# Altium schematic sheet Interface.SchDoc: Krapong-ROV, F-Tube (Sensor, Interface)
size A4; DocumentNumber: 3; SheetNumber: 4; SheetTotal: 4; PageSetup: Record=PageOptions|CenterHorizontal=True|CenterVertical=True|PrintScale=0.97|XCorrection=1.00|YCorrection=1.00|PrintKind=0|BorderSize=5000000|LeftOffset=0|BottomOffset=0|Orientation=2|PaperLength=1000|PaperWidth=1000|Scale=100|PaperSource=7|PrintQuality=-3|MediaType=1|DitherType=10|PrintScaleMode=1|PaperKind=A4|PaperIndex=9
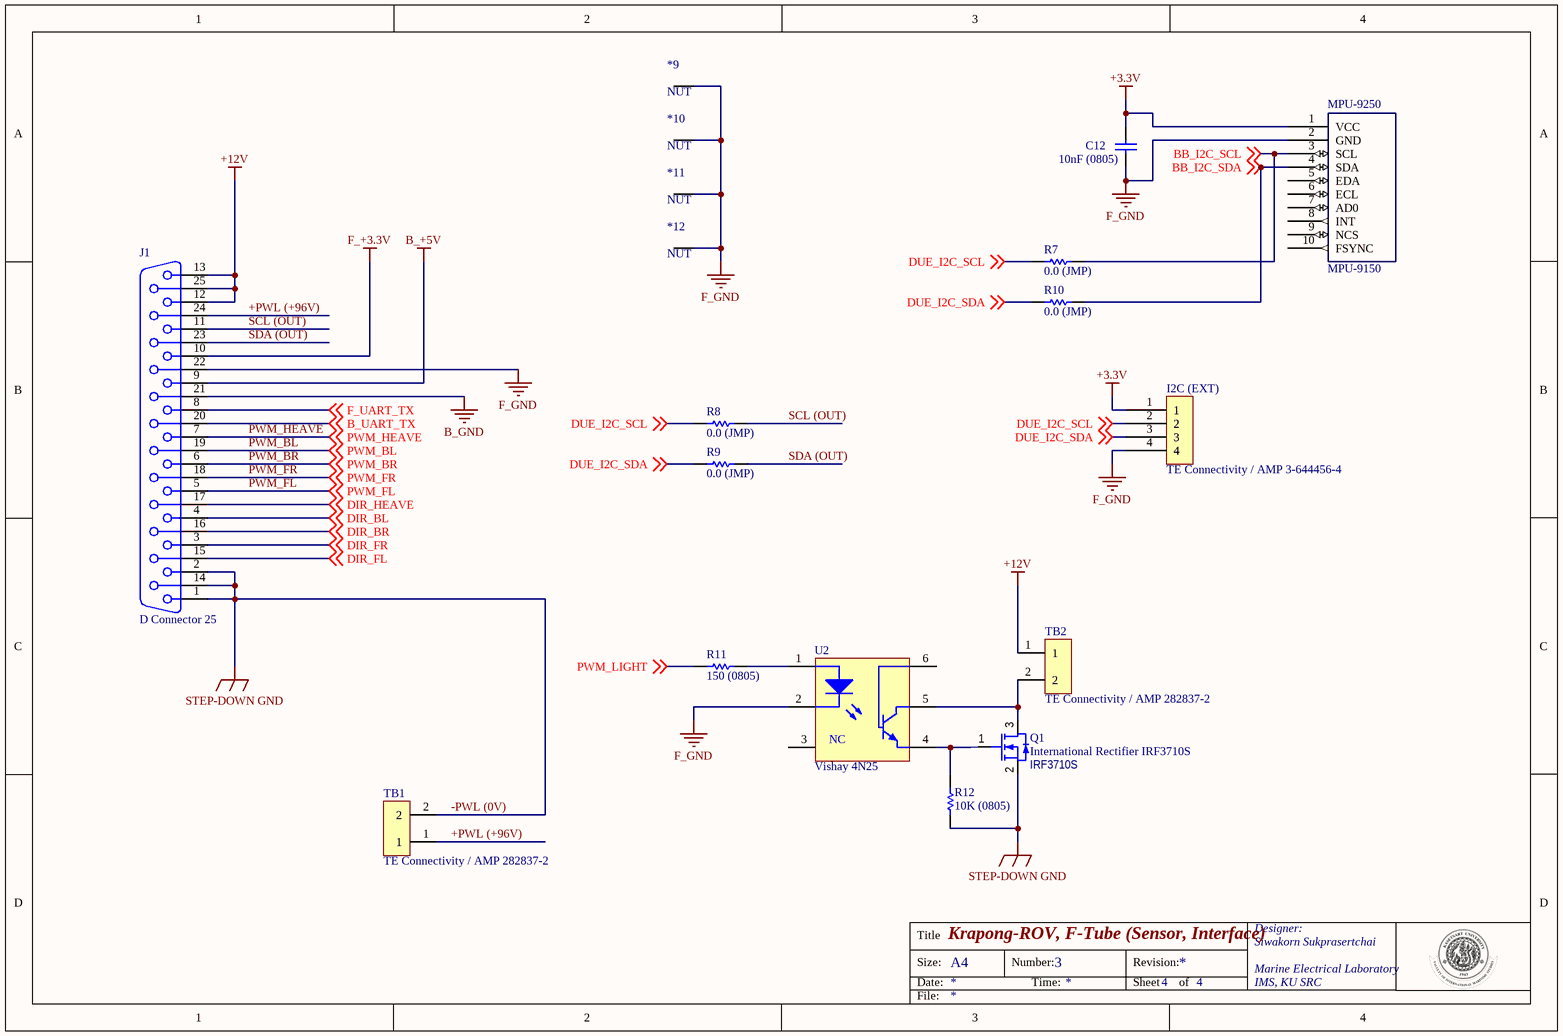
[diagram p0: Interface.SchDoc]

## Parts
*9  NUT  [PCB-pcj1l6roq5gpi9u538ps-1]
*10  NUT  [PCB-pcj1l6roq5gpi9u538ps-1]
*11  NUT  [PCB-pcj1l6roq5gpi9u538ps-1]
*12  NUT  [PCB-pcj1l6roq5gpi9u538ps-1]
C12  10nF (0805)  [CAPC2013X94X50NL20T25]
I2C_(EXT)  TE Connectivity / AMP 3-644456-4  [PCB-rz6n0fnwkrymh4bzf5j3-1]
J1  D Connector 25  [PCB-w6wyndea0hgjvu195v0z-1]
MPU-9250  MPU-9150  [PCB-qjnj89ydof8zhvyyt2pp-1]
Q1  International Rectifier IRF3710S  Vlaue: IRF3710S  [PCB-knfcvcmaqkz1jt91xuml-1]
R7  0.0 (JMP)  [RESC2013X60X35ML10T20]
R8  0.0 (JMP)  [RESC2013X60X35ML10T20]
R9  0.0 (JMP)  [RESC2013X60X35ML10T20]
R10  0.0 (JMP)  [RESC2013X60X35ML10T20]
R11  150 (0805)  [RESC2013X60X40NL15T20]
R12  10K (0805)  [RESC2013X60X40NL15T20]
TB1  TE Connectivity / AMP 282837-2  [PCB-suk0edwv8aq1tcw7107x-1]
TB2  TE Connectivity / AMP 282837-2  [PCB-suk0edwv8aq1tcw7107x-1]
U2  Vishay 4N25  [PCB-jnahbn6qvly565f94r9b-1]

## Nets
+3.3V: C12.2 I2C_(EXT).1 MPU-9250.1(VCC)
+12V: J1.12 J1.13 J1.25 TB2.1
-PWL (0V): J1.1 J1.2 J1.14 Q1.2(S) R12.1 TB1.2  [also labelled STEP-DOWN GND]
B_+5V: J1.9
B_GND: J1.21
F_+3.3V: J1.10
F_GND: *9.0 *10.0 *11.0 *12.0 C12.1 I2C_(EXT).4 J1.22 MPU-9250.2(GND) U2.2
+PWL (+96V): J1.24 TB1.1
B_UART_TX: J1.20 ; off-sheet B_UART_TX
BB_I2C_SCL: MPU-9250.3(SCL) R7.1 ; off-sheet BB_I2C_SCL
BB_I2C_SDA: MPU-9250.4(SDA) R10.1 ; off-sheet BB_I2C_SDA
DIR_BL: J1.4 ; off-sheet DIR_BL
DIR_BR: J1.16 ; off-sheet DIR_BR
DIR_FL: J1.15 ; off-sheet DIR_FL
DIR_FR: J1.3 ; off-sheet DIR_FR
DIR_HEAVE: J1.17 ; off-sheet DIR_HEAVE
DUE_I2C_SCL: I2C_(EXT).2 R7.2 R8.2 ; off-sheet DUE_I2C_SCL
DUE_I2C_SDA: I2C_(EXT).3 R9.2 R10.2 ; off-sheet DUE_I2C_SDA
F_UART_TX: J1.8 ; off-sheet F_UART_TX
PWM_BL: J1.19 ; off-sheet PWM_BL
PWM_BR: J1.6 ; off-sheet PWM_BR
PWM_FL: J1.5 ; off-sheet PWM_FL
PWM_FR: J1.18 ; off-sheet PWM_FR
PWM_HEAVE: J1.7 ; off-sheet PWM_HEAVE
PWM_LIGHT: R11.2 ; off-sheet PWM_LIGHT
SCL (OUT): J1.11 R8.1
SDA (OUT): J1.23 R9.1
NetQ1_1: Q1.1(G) R12.2 U2.4
NetQ1_3: Q1.3(D) TB2.2 U2.5
NetR11_1: R11.1 U2.1

Not connected (* = marked no-connect by the designer): MPU-9250 5(EDA) 6(ECL) 7(AD0) 8(INT) 9(NCS) 10(FSYNC); U2 3 6

## Notes on the sheet
- Title
- Size:
- Date:
- A4
- Number:
- Time:
- Revision:
- Sheet
- of
- Designer:
- Siwakorn Sukprasertchai
- Marine Electrical Laboratory
- IMS, KU SRC
- File:
- (in symbol CMP-1524877-3) NC

## Library data of the parts
*9-*12 = CMP-5ddc94dc62be821b-2: Standoff; 12 mm; M3 x 0.5; Brass; Hex; Nickel Plate; 8 in.; 8 in.; Manufacturer Part Number: 24314; Lead-Free Status: Lead Free; Size-Width: 5.00 mm; Octopart URL: http://octopart.com/24314-keystone-662020; OctopartID: 5ddc94dc62be821b; Size-Length: 12.0 mm; Material: Brass; RoHS: Compliant
C12 = CMP-16466678-5: CAP CER 10NF 50V 5% X7R 0805; Manufacturer Part Number: 08055C103JAT2A; Case/Package (SI): 2012; Capacitance: 1e-08 F; Voltage Rating (DC): 50.0 V; Dielectric Material: Ceramic Multilayer; Lead-Free Status: Lead Free; Insulation Resistance: 1e+11 ?; Size-Width: 0.0012446 m; REACH SVHC Compliance: No SVHC; Capacitance Tolerance: ±5%; Case/Package: 0805; Mounting Style: Surface Mount; Size-Thickness: 0.0009398 m; Dielectric Characteristic: X7R; Octopart Url: https://octopart.com/08055c103jat2a-avx+interconnect+%2F+elco-39513106; Size-Height: 0.00094 m; Size-Length: 0.0020066 m; Number of Pins: 2; RoHS: Compliant; OctopartID: 02fac9aacb8edd3d
I2C_(EXT) = CMP-aedf658f79ea7118-2: Board-To-Board Connector, MTA-100 Series, Through Hole, Header, 4, 2.54 mm, Tin Plated Contacts; Gender: Male; Pin Pitch: 2.54 mm; Number of Positions: 4; Shrouded: No; Lead-Free Status: Lead Free; Voltage Rating (AC): 250 V; Mounting Angle: 180 °; ELV Compliant: Compliant; Size-Width: 2.34 mm; Number of Rows: 1; Housing Material: Polyester; Flammability Rating: UL 94 V-0; Contact Material: Copper Alloy; Octopart URL: http://octopart.com/3-644456-4-te+connectivity+%2F+amp-39514707; Contact Plating: Tin; Mounting Style: Through Hole; Number of Contacts: 4; Manufacturer Part Number: 3-644456-4; Lifecycle Status: Active; Housing Color: Natural; RoHS: Compliant; Size-Length: 9.86 mm; Orientation: Vertical; OctopartID: aedf658f79ea7118; Size-Height: 2.54 mm; Packaging: Box, Bag
J1 = CMP-d8a713f745850760-3: D Sub Connector, Amplimite HD-20, Amplimite HD-20 Series, DB, Plug, 25, Metal, Solder; Manufacturer Part Number: 5747842-4; ELV Compliant: Compliant; Gender: Male; Lead-Free Status: Lead Free; Pin Pitch: 2.77 mm; Number of Contacts: 25; Orientation: Right Angle; Packaging: Tray; Housing Color: Black; Mounting Style: Through Hole; RoHS: Compliant; Lifecycle Status: Active; Size-Length: 53.0 mm; Color: Black; Contact Plating: Gold over Nickel; OctopartID: d8a713f745850760; Contact Material: Brass; Number of Rows: 2; Size-Height: 12.6 mm; Housing Material: Nylon; Octopart URL: http://octopart.com/5747842-4-te+connectivity+%2F+amp-39499844; REACH SVHC Compliance: No SVHC; Material: Steel; Flammability Rating: UL 94 V-0; Number of Positions: 25; Size-Width: 18.7 mm
MPU-9250 = CMP-arxnhq8o6hyvnzrq5u03-1: MPU-9150 or GY-Series; CustomComponentID: arxnhq8o6hyvnzrq5u03
Q1 = CMP-3cf2f5f9d0cee335-1: 100V Single N-Channel HEXFET Power MOSFET in a D2-Pak package; Breakdown Voltage (Drain to Source): 100 V (min); Current Rating: 57.0 A; Lead-Free Status: Contains Lead; Rise Time: 58.0 ns; Drain to Source Resistance (on) (Rds): 23.0 m? (max); Power Dissipation: 3.80 W; Octopart URL: http://octopart.com/irf3710s-international+rectifier-117082; Manufacturer Part Number: IRF3710S; Polarity: N-Channel; Voltage Rating (DC): 100 V; Part Family: IRF3710S; Drain to Source Voltage (Vds): 100 V; Mounting Style: Surface Mount; Packaging: Bulk; Lifecycle Status: Pending Obsolescence; RoHS: Non-Compliant; Continuous Drain Current (Ids): 57.0 A; OctopartID: 3cf2f5f9d0cee335
R7-R10 = CMP-1875921-8: Res Thick Film 0805 0 Ohm Molded SMD Paper T/R; Manufacturer Part Number: RC0805FR-070RL; Resistance: 0.0 ?; Lead-Free Status: Lead Free; Resistance Tolerance: ±1%; OctopartID: f3d13a5618eb2c16; Case/Package: 0805; Octopart Url: https://octopart.com/rc0805fr-070rl-yageo-9293404; Mounting Style: Surface Mount; RoHS: Compliant
R11 R12 = CMP-1860549-2: RES SMD 10K OHM 1% 1/3W 0805; Lead-Free Status: Lead Free; Power Rating: 0.125 W; Resistance: 10000.0 ?; Voltage Rating (DC): 150.0 V; Case/Package: 0805; Mounting Style: Surface Mount; Number of Pins: 2; Octopart Url: https://octopart.com/crcw080510k0fkeahp-vishay-42634554; OctopartID: fa6931e9523525ae; Packaging: Cut Tape (CT); REACH SVHC Compliance: No SVHC; Resistance Tolerance: ±1%; RoHS: Compliant
TB1 TB2 = CMP-50ff9bac89d88f38-13: Connector Terminal Blocks Receptacle 2 Position 5.08mm Solder Straight Thru-Hole 13.5A/Contact; Number of Contacts: 2; ELV Compliant: Compliant; Lead-Free Status: Lead Free; Voltage Rating (AC): 250 V; Lifecycle Status: Active; Contact Material: Brass; OctopartID: ced9058a17fd111e; Packaging: Bulk; Mounting Style: PC Board, PCB; Octopart URL: http://octopart.com/282837-2-te+connectivity+%2F+amp-39451714; Flammability Rating: UL 94 V-0; Orientation: Right Angle; Housing Material: Nylon 6/6; Color: Green; RoHS: Compliant; Housing Color: Green; Number of Positions: 2; Contact Plating: Tin; Manufacturer Part Number: 282837-2
U2 = CMP-1524877-3: 1 Channel Transistor Output Optocoupler 1 Channel Transistor Output Optocoupler; Lead-Free Status: Lead Free; Isolation Voltage: 600 V; Input Current: 50.0 mA; Output Voltage: 30.0 V; Rise Time: 3.00 µs; Input Voltage (DC): 1.20 V; Number of Circuits: 1; Octopart URL: http://octopart.com/4n25-vishay-55433896; Manufacturer Part Number: 4N25; RoHS: Compliant; Mounting Style: Through Hole; Packaging: Tube; Number of Pins: 6; Case/Package: DIP; Number of Channels: 1; OctopartID: 1bb3d1f4e47dc474